# Altium schematic sheet HighSideDrivers.SchDoc
size A
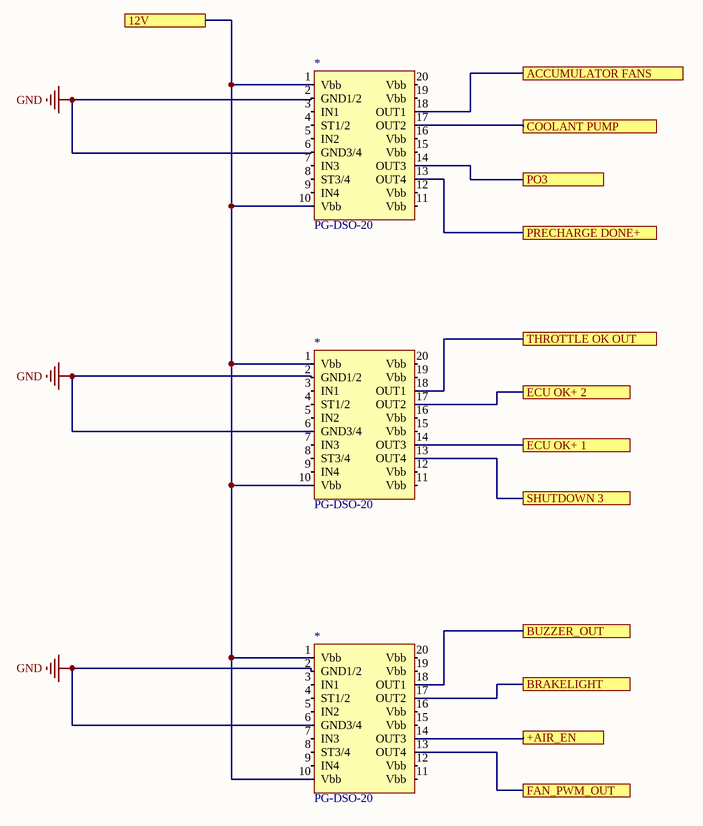
[diagram p0: HighSideDrivers.SchDoc]

## Parts
(Parts that share a designator on the sheet are numbered #1, #2 ... from top to bottom, then left to right.)
*#1  PG-DSO-20  [PG-DSO-20]
*#2  PG-DSO-20  [PG-DSO-20]
*#3  PG-DSO-20  [PG-DSO-20]

## Ports
12V, +AIR_EN, ACCUMULATOR FANS, BRAKELIGHT, BUZZER_OUT, COOLANT PUMP, ECU OK+ 1, ECU OK+ 2, FAN_PWM_OUT, PO3, PRECHARGE DONE+, SHUTDOWN 3, THROTTLE OK OUT

## Nets
GND: *#1.2(GND1/2) *#1.6(GND3/4) *#2.2(GND1/2) *#2.6(GND3/4) *#3.2(GND1/2) *#3.6(GND3/4)
12V: *#1.1(Vbb) *#1.10(Vbb) *#2.1(Vbb) *#2.10(Vbb) *#3.1(Vbb) *#3.10(Vbb) ; port 12V
+AIR_EN: *#3.14(OUT3) ; port +AIR_EN
ACCUMULATOR FANS: *#1.18(OUT1) ; port ACCUMULATOR FANS
BRAKELIGHT: *#3.17(OUT2) ; port BRAKELIGHT
BUZZER_OUT: *#3.18(OUT1) ; port BUZZER_OUT
COOLANT PUMP: *#1.17(OUT2) ; port COOLANT PUMP
ECU OK+ 1: *#2.14(OUT3) ; port ECU OK+ 1
ECU OK+ 2: *#2.17(OUT2) ; port ECU OK+ 2
FAN_PWM_OUT: *#3.13(OUT4) ; port FAN_PWM_OUT
PO3: *#1.14(OUT3) ; port PO3
PRECHARGE DONE+: *#1.13(OUT4) ; port PRECHARGE DONE+
SHUTDOWN 3: *#2.13(OUT4) ; port SHUTDOWN 3
THROTTLE OK OUT: *#2.18(OUT1) ; port THROTTLE OK OUT

Not connected (* = marked no-connect by the designer): *#1 3(IN1) 4(ST1/2) 5(IN2) 7(IN3) 8(ST3/4) 9(IN4) 11(Vbb) 12(Vbb) 15(Vbb) 16(Vbb) 19(Vbb) 20(Vbb); *#2 3(IN1) 4(ST1/2) 5(IN2) 7(IN3) 8(ST3/4) 9(IN4) 11(Vbb) 12(Vbb) 15(Vbb) 16(Vbb) 19(Vbb) 20(Vbb); *#3 3(IN1) 4(ST1/2) 5(IN2) 7(IN3) 8(ST3/4) 9(IN4) 11(Vbb) 12(Vbb) 15(Vbb) 16(Vbb) 19(Vbb) 20(Vbb)

## Library data of the parts
*#1-*#3 = 6: Manufacturer_id: 1; idIC_Misc: 6; Name: BTS716G High Side Driver; Drawer_id: 1